# Altium schematic sheet Conns.SchDoc
size A4
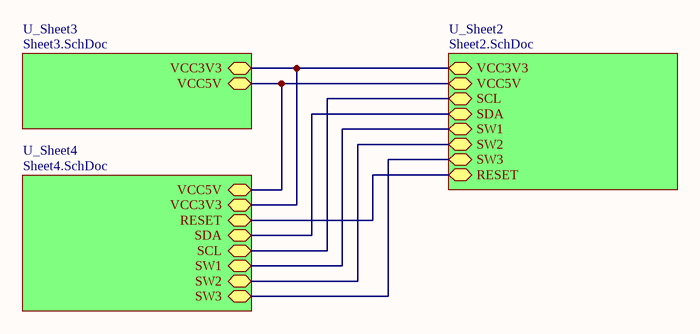
[diagram p0: Conns.SchDoc]

## Sub-sheets
U_Sheet2 = Sheet2.SchDoc: VCC3V3 (bidir), VCC5V (bidir), SCL (bidir), SDA (bidir), SW1 (bidir), SW2 (bidir), SW3 (bidir), RESET (bidir)
U_Sheet3 = Sheet3.SchDoc: VCC5V (bidir), VCC3V3 (bidir)
U_Sheet4 = Sheet4.SchDoc: VCC5V (bidir), VCC3V3 (bidir), RESET (bidir), SDA (bidir), SCL (bidir), SW1 (bidir), SW2 (bidir), SW3 (bidir)

## Nets
(unnamed): sheet U_Sheet3/VCC5V, sheet U_Sheet2/VCC5V, sheet U_Sheet4/VCC5V
(unnamed): sheet U_Sheet3/VCC3V3, sheet U_Sheet2/VCC3V3, sheet U_Sheet4/VCC3V3
(unnamed): sheet U_Sheet2/SCL, sheet U_Sheet4/SCL
(unnamed): sheet U_Sheet2/SDA, sheet U_Sheet4/SDA
(unnamed): sheet U_Sheet2/SW1, sheet U_Sheet4/SW1
(unnamed): sheet U_Sheet2/SW2, sheet U_Sheet4/SW2
(unnamed): sheet U_Sheet2/SW3, sheet U_Sheet4/SW3
(unnamed): sheet U_Sheet2/RESET, sheet U_Sheet4/RESET